# EAGLE schematic Scoreboard wire connection (EAGLE 9.1.0)
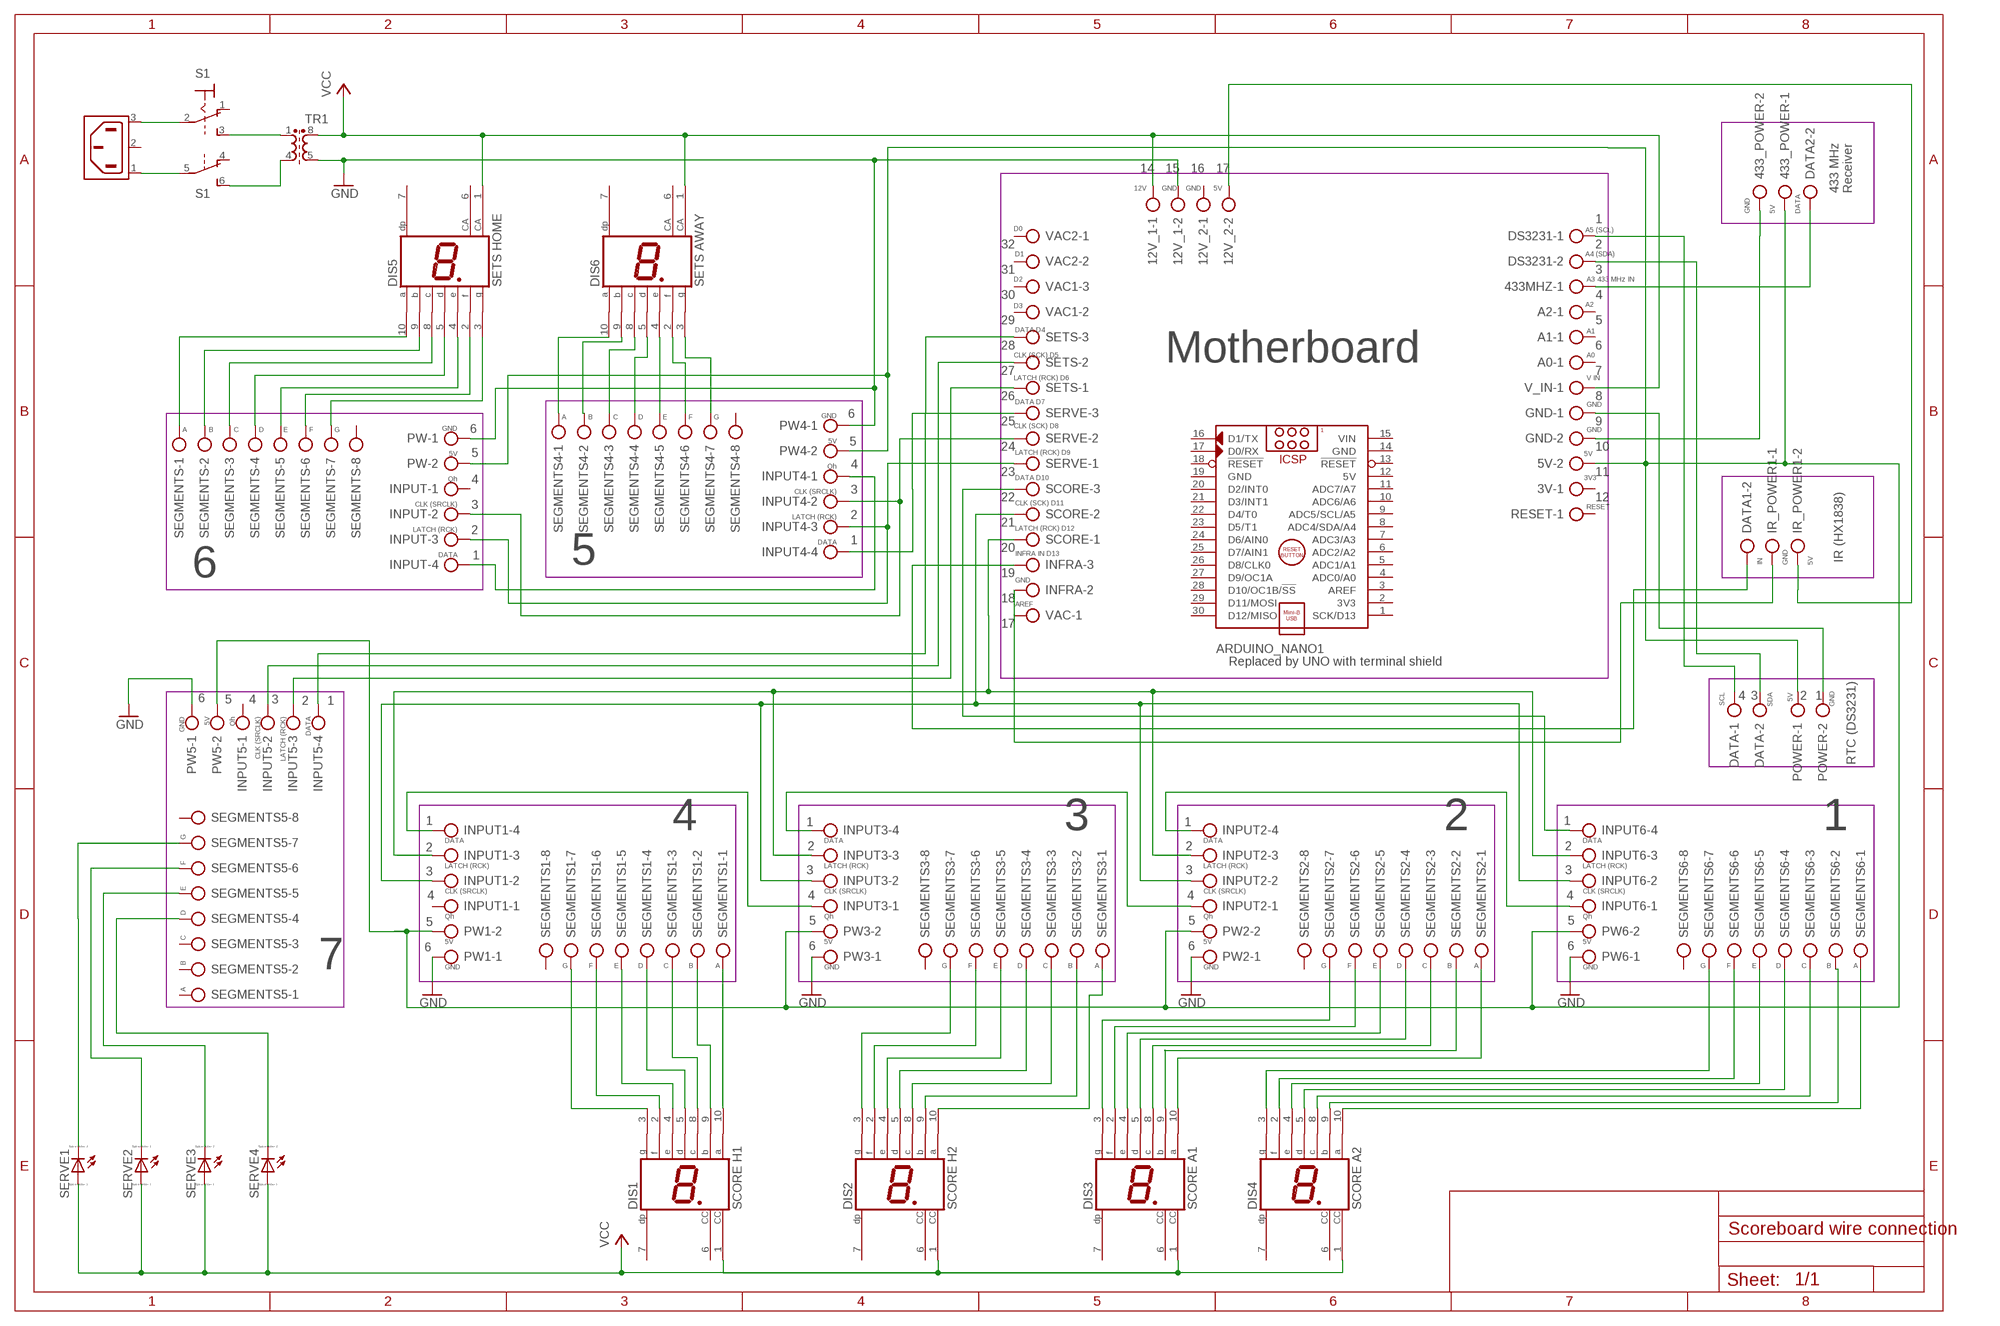
[diagram p0: schematic, sheet 1]

## Parts
3V  AK300/2  [AK300/2]
5V  AK300/2  [AK300/2]
12V_1  AK300/2  [AK300/2]
12V_2  AK300/2  [AK300/2]
433_POWER  AK300/2  [AK300/2]
433MHZ  AK300/2  [AK300/2]
A0  AK300/2  [AK300/2]
A1  AK300/2  [AK300/2]
A2  AK300/2  [AK300/2]
ARDUINO_NANO1  ARDUINO_NANO  [ARDUINO_NANO]
DATA  AK300/2  [AK300/2]
DATA1  AK300/2  [AK300/2]
DATA2  AK300/2  [AK300/2]
DIS1  SCORE H1  HD-A103  [HDSP-A]
DIS2  SCORE H2  HD-A103  [HDSP-A]
DIS3  SCORE A1  HD-A103  [HDSP-A]
DIS4  SCORE A2  HD-A103  [HDSP-A]
DIS5  SETS HOME  HD-F101  [HDSP-E]
DIS6  SETS AWAY  HD-F101  [HDSP-E]
DS3231  AK300/2  [AK300/2]
GND  AK300/2  [AK300/2]
INFRA  AK300/3  [AK300/3]
INPUT  AK300/4  [AK300/4]
INPUT1  AK300/4  [AK300/4]
INPUT2  AK300/4  [AK300/4]
INPUT3  AK300/4  [AK300/4]
INPUT4  AK300/4  [AK300/4]
INPUT5  AK300/4  [AK300/4]
INPUT6  AK300/4  [AK300/4]
IR_POWER1  AK300/2  [AK300/2]
POWER  AK300/2  [AK300/2]
PW  AK300/2  [AK300/2]
PW1  AK300/2  [AK300/2]
PW2  AK300/2  [AK300/2]
PW3  AK300/2  [AK300/2]
PW4  AK300/2  [AK300/2]
PW5  AK300/2  [AK300/2]
PW6  AK300/2  [AK300/2]
RESET  AK300/2  [AK300/2]
S1  M9040P2  [M9040P2]
SCORE  AK300/3  [AK300/3]
SEGMENTS  AK300/8  [AK300/8]
SEGMENTS1  AK300/8  [AK300/8]
SEGMENTS2  AK300/8  [AK300/8]
SEGMENTS3  AK300/8  [AK300/8]
SEGMENTS4  AK300/8  [AK300/8]
SEGMENTS5  AK300/8  [AK300/8]
SEGMENTS6  AK300/8  [AK300/8]
SERVE  AK300/3  [AK300/3]
SERVE1  LED_E  [LED_1206]
SERVE2  LED_E  [LED_1206]
SERVE3  LED_E  [LED_1206]
SERVE4  LED_E  [LED_1206]
SETS  AK300/3  [AK300/3]
TR1  SMR6-2W  [SM-R6]
V_IN  AK300/2  [AK300/2]
VAC  AK300/2  [AK300/2]
VAC1  AK300/3  [AK300/3]
VAC2  AK300/2  [AK300/2]
X7  6ESRM-P  [6ESRM-P]

## Nets
5V1: 5V.2 433_POWER.1 POWER.1 PW1.2 PW2.2 PW3.2 PW4.2 PW5.2 PW6.2 PW.2
5V_INFRA: 12V_2.2 IR_POWER1.2
12V: 12V_1.1 DIS1.1(CC) DIS2.1(CC) DIS3.1(CC) DIS4.1(CC) DIS5.1(CA) DIS6.1(CA) SERVE1.A SERVE2.A SERVE3.A SERVE4.A TR1.8 V_IN.1 ; supply symbol labelled VCC
433GND: 433_POWER.2 GND.2
GND: 12V_1.2 PW1.1 PW2.1 PW3.1 PW4.1 PW5.1 PW6.1 PW.1 TR1.5
L: S1.5(2:P) X7.1(AC1)
N: S1.2(1:P) X7.3(AC2)
N$1: S1.6(2:S) TR1.4
N$2: S1.3(1:S) TR1.1
N$3: DIS4.10(A) SEGMENTS6.1
N$4: DIS4.9(B) SEGMENTS6.2
N$5: DIS4.8(C) SEGMENTS6.3
N$6: DIS4.5(D) SEGMENTS6.4
N$7: DIS4.4(E) SEGMENTS6.5
N$8: DIS4.2(F) SEGMENTS6.6
N$9: DIS4.3(G) SEGMENTS6.7
N$10: INPUT2.4 INPUT6.1
N$11: INPUT1.4 INPUT3.1
N$12: DIS3.10(A) SEGMENTS2.1
N$13: INPUT6.4 SCORE.3
N$14: INPUT2.1 INPUT3.4
N$15: DIS3.9(B) SEGMENTS2.2
N$16: DIS3.8(C) SEGMENTS2.3
N$17: DIS3.5(D) SEGMENTS2.4
N$18: DIS3.4(E) SEGMENTS2.5
N$19: DIS3.2(F) SEGMENTS2.6
N$20: DIS3.3(G) SEGMENTS2.7
N$21: DIS2.10(A) SEGMENTS3.1
N$22: DIS2.9(B) SEGMENTS3.2
N$23: DIS2.8(C) SEGMENTS3.3
N$24: DIS2.5(D) SEGMENTS3.4
N$25: DIS2.4(E) SEGMENTS3.5
N$26: DIS2.2(F) SEGMENTS3.6
N$27: DIS2.3(G) SEGMENTS3.7
N$28: INPUT4.4 SERVE.3
N$29: DIS1.10(A) SEGMENTS1.1
N$30: DIS1.9(B) SEGMENTS1.2
N$31: DIS1.8(C) SEGMENTS1.3
N$32: DIS1.5(D) SEGMENTS1.4
N$33: DIS1.4(E) SEGMENTS1.5
N$34: DIS1.2(F) SEGMENTS1.6
N$35: DIS1.3(G) SEGMENTS1.7
N$36: INPUT4.3 INPUT.3 SERVE.1
N$37: INPUT4.2 INPUT.2 SERVE.2
N$38: INPUT4.1 INPUT.4
N$39: DIS5.5(D) SEGMENTS.4
N$40: DIS5.8(C) SEGMENTS.3
N$41: DIS6.10(A) SEGMENTS4.1
N$42: DIS6.9(B) SEGMENTS4.2
N$43: DIS6.8(C) SEGMENTS4.3
N$44: DIS6.5(D) SEGMENTS4.4
N$45: DIS6.4(E) SEGMENTS4.5
N$46: DIS6.2(F) SEGMENTS4.6
N$47: DIS6.3(G) SEGMENTS4.7
N$48: DIS5.3(G) SEGMENTS.7
N$49: DIS5.2(F) SEGMENTS.6
N$50: DIS5.4(E) SEGMENTS.5
N$51: DIS5.9(B) SEGMENTS.2
N$52: DIS5.10(A) SEGMENTS.1
N$53: INFRA.2 IR_POWER1.1
N$54: INPUT5.3 SETS.1
N$55: INPUT5.2 SETS.2
N$56: INPUT5.4 SETS.3
N$57: SEGMENTS5.4 SERVE4.C
N$58: SEGMENTS5.5 SERVE3.C
N$59: SEGMENTS5.6 SERVE2.C
N$60: SEGMENTS5.7 SERVE1.C
N$61: GND.1 POWER.2
N$62: DATA.1 DS3231.1
N$64: DATA1.2 INFRA.3
N$65: 433MHZ.1 DATA2.2
N$67: DATA.2 DS3231.2
SCORE_CLK: INPUT1.2 INPUT2.2 INPUT3.2 INPUT6.2 SCORE.2
SCORE_LATCH: INPUT1.3 INPUT2.3 INPUT3.3 INPUT6.3 SCORE.1
Unconnected: 3V.1 3V.2 5V.1 12V_2.1 433MHZ.2 A0.1 A0.2 A1.1 A1.2 A2.1 A2.2 ARDUINO_NANO1.1(SCK/D13) ARDUINO_NANO1.2(3V3) ARDUINO_NANO1.3(AREF) ARDUINO_NANO1.4(ADC0/A0) ARDUINO_NANO1.5(ADC1/A1) ARDUINO_NANO1.6(ADC2/A2) ARDUINO_NANO1.7(ADC3/A3) ARDUINO_NANO1.8(ADC4/SDA/A4) ARDUINO_NANO1.9(ADC5/SCL/A5) ARDUINO_NANO1.10(ADC6/A6) ARDUINO_NANO1.11(ADC7/A7) ARDUINO_NANO1.13(!RESET) ARDUINO_NANO1.16(D1/TX) ARDUINO_NANO1.17(D0/RX) ARDUINO_NANO1.18(!RESET) ARDUINO_NANO1.20(D2/INT0) ARDUINO_NANO1.21(D3/INT1) ARDUINO_NANO1.22(D4/T0) ARDUINO_NANO1.23(D5/T1) ARDUINO_NANO1.24(D6/AIN0) ARDUINO_NANO1.25(D7/AIN1) ARDUINO_NANO1.26(D8/CLK0) ARDUINO_NANO1.27(D9/OC1A) ARDUINO_NANO1.28(D10/OC1B/!SS) ARDUINO_NANO1.29(D11/MOSI) ARDUINO_NANO1.30(D12/MISO) DATA1.1 DATA2.1 DIS1.6(CC) DIS1.7(DP) DIS2.6(CC) DIS2.7(DP) DIS3.6(CC) DIS3.7(DP) DIS4.6(CC) DIS4.7(DP) DIS5.6(CA) DIS5.7(DP) DIS6.6(CA) DIS6.7(DP) INFRA.1 INPUT1.1 INPUT5.1 INPUT.1 RESET.1 RESET.2 S1.1(1:O) S1.4(2:O) SEGMENTS1.8 SEGMENTS2.8 SEGMENTS3.8 SEGMENTS4.8 SEGMENTS5.1 SEGMENTS5.2 SEGMENTS5.3 SEGMENTS5.8 SEGMENTS6.8 SEGMENTS.8 V_IN.2 VAC1.1 VAC1.2 VAC1.3 VAC2.1 VAC2.2 VAC.1 VAC.2 X7.2(SH)

## Notes on the sheet
- 14 | 15 | 16 | 17
- 12V | GND | GND | 5V
- 433 MHz
  Receiver
- GND | 5V | DATA
- 1
- D0 | A5 (SCL)
- 32 | 2
- D1 | A4 (SDA)
- 31 | 3
- D2 | A3 433 MHz IN
- 30 | 4
- D3 | A2
- 29 | 5
- DATA D4 | A1
- 28 | 6
- CLK (SCK) D5 | A0
- Motherboard
- 27 | 7
- LATCH (RCK) D6 | V IN
- 26 | 8
- DATA D7
- GND
- A | B | C | D | E | F | G | GND
- 6
- A | B | C | D | E | F | G | GND | 25 | 9
- CLK (SCK) D8
- 6 | GND
- 5V
- 5
- 5V | 24 | 10
- LATCH (RCK) D9 | 5V
- 5
- Qh
- 4
- Qh | 23 | 11
- DATA D10 | 3V3
- 4
- CLK (SRCLK)
- 3
- CLK (SRCLK) | 22 | 12
- CLK (SCK) D11
- 3 | RESET
- LATCH (RCK)
- 2
- LATCH (RCK) | 21
- LATCH (RCK) D12
- 2
- DATA
- 1
- DATA | 20
- INFRA IN D13
- 1 | IR (HX1838)
- 6 | 5 | IN | GND | 5V
- 19
- GND
- 18
- AREF
- 17
- Replaced by UNO with terminal shield
- SCL
- 6 | 4 | 3 | 5V | 2 | 1
- 5 | 4 | 3 | 2 | 1
- SDA | GND
- GND | 5V | Qh | CLK (SRCLK) | LATCH (RCK) | DATA
- RTC (DS3231)
- 1 | 1 | 1 | 1
- 4 | 3 | 2 | 1
- G
- DATA | DATA | DATA | DATA
- 2 | 2 | 2 | 2
- F
- LATCH (RCK) | LATCH (RCK) | LATCH (RCK) | LATCH (RCK)
- 3 | 3 | 3 | 3
- E
- CLK (SRCLK) | CLK (SRCLK) | CLK (SRCLK) | CLK (SRCLK)
- 4 | 4 | 4 | 4
- D
- Qh | Qh | Qh | Qh
- 5 | 5 | 5 | 5
- C
- 5V | 5V | 5V | 5V
- 6 | 6 | 6 | 6
- B
- 7 | GND | G | F | E | D | C | B | A | GND | G | F | E | D | C | B | A | GND | G | F | E | D | C | B | A | GND | G | F | E | D | C | B | A
- A

## Power pins joined to a net without a drawn wire
5V: ARDUINO_NANO1.12(5V)
GND: ARDUINO_NANO1.14(GND) ARDUINO_NANO1.19(GND)
VIN: ARDUINO_NANO1.15(VIN)

## Library data of the parts
3V 5V 12V_1 12V_2 433_POWER 433MHZ A0 A1 A2 DATA DATA1 DATA2 DS3231 GND IR_POWER1 POWER PW PW1-PW6 RESET V_IN VAC VAC2 = con-ptr500:AK300/2: CONNECTOR; OC_FARNELL: unknown; OC_NEWARK: unknown
ARDUINO_NANO1 = ArduinoNanoV30:ARDUINO_NANO: Arduino Nano V3.0 Module Overview: The Arduino Nano is a small, complete, and breadboard-friendly board based on the ATmega328 (Arduino Nano 3.x) or ATmega168 (Arduino Nano 2.x). It has more or less the same functionality of the Arduino Duemilanove, but in a different package. It lacks only a DC power jack, and works with a Mini-B USB cable instead of a standard one. The Nano was designed and is being produced by Gravitech <http://www.gravitech.us/arna30wiatp.html>. General specifications: Item Value Microcontroller Atmel ATmega168 or ATmega328 Operating Voltage (logic level) 5 V Input Voltage (recommended) 7-12 V Input Voltage (limits) 6-20 V Digital I/O Pins 14 (of which 6 provide PWM output) Analog Input Pins 8 DC Current per I/O Pin 40 mA Flash Memory 16 KB (ATmega168) or 32 KB (ATmega328) of which 2 KB used by bootloader SRAM 1 KB (ATmega168) or 2 KB (ATmega328) EEPROM 512 bytes (ATmega168) or 1 KB (ATmega328) Clock Speed 16 MHz Dimensions (Inches) 0.73" x 1.70" Dimensions (mm) 18mm x 45mm Overall height About 9 mm (not including pins) Weigth 5 g Power: The Arduino Nano can be powered via the Mini-B USB connection, 6-20V unregulated external power supply (pin 30), or 5V regulated external power supply (pin 27). The power source is automatically selected to the highest voltage source. Memory: The ATmega168 has 16 KB of flash memory for storing code (of which 2 KB is used for the bootloader); the ATmega328 has 32 KB, (also with 2 KB used for the bootloader). The ATmega168 has 1 KB of SRAM and 512 bytes of EEPROM (which can be read and written with the EEPROM library); the ATmega328 has 2 KB of SRAM and 1 KB of EEPROM. Input and Output: Each of the 14 digital pins on the Nano can be used as an input or output, using pinMode(), digitalWrite(), and digitalRead() functions. They operate at 5 volts. Each pin can provide or receive a maximum of 40 mA and has an internal pull-up resistor (disconnected by default) of 20-50 kOhms. In addition, some pins have specialized functions. Visit Arduino - ArduinoBoardNano <https://www.arduino.cc/en/Main/ArduinoBoardNano>
DIS1-DIS4 = display-hp:HD-A103: LED DISPLAY 1-character 7 segment, decimal point right; OC_FARNELL: unknown; OC_NEWARK: unknown
DIS5 DIS6 = display-hp:HD-F101: LED DISPLAY 1-character 7 segment, decimal point right; OC_FARNELL: unknown; OC_NEWARK: unknown
INFRA SCORE SERVE SETS VAC1 = con-ptr500:AK300/3: CONNECTOR; OC_FARNELL: unknown; OC_NEWARK: unknown
INPUT INPUT1-INPUT6 = con-ptr500:AK300/4: CONNECTOR; OC_FARNELL: unknown; OC_NEWARK: unknown
S1 = switch:M9040P2: TOGGLE SWITCH Marquardt
SEGMENTS SEGMENTS1-SEGMENTS6 = con-ptr500:AK300/8: CONNECTOR; OC_FARNELL: unknown; OC_NEWARK: unknown
SERVE1-SERVE4 = eagle-ltspice:LED_E: LED Source: http://www.osram.convergy.de Source: www.luxeon.com Source: www.kingbright.com; SPICEMODEL: NONE; SPICEPREFIX: D; SPICETYPE: diode
TR1 = inductor-neosid:SMR6-2W: TRANSFORMER SMD toroidal-core transformer with 2 windings; OC_FARNELL: unknown; OC_NEWARK: unknown
X7 = con-tycoelectronics:6ESRM-P: AC Connector 120/250 VAC Source: http://catalog.tycoelectronics.com .. ENG_DS_1654001_1099_SR_0406.pdf; MF: TYCO ELECTRONICS; MPN: 6ESRM-P; OC_FARNELL: unknown; OC_NEWARK: 87F1821